# EAGLE design STC31 Breakout (EAGLE 9.6.2)
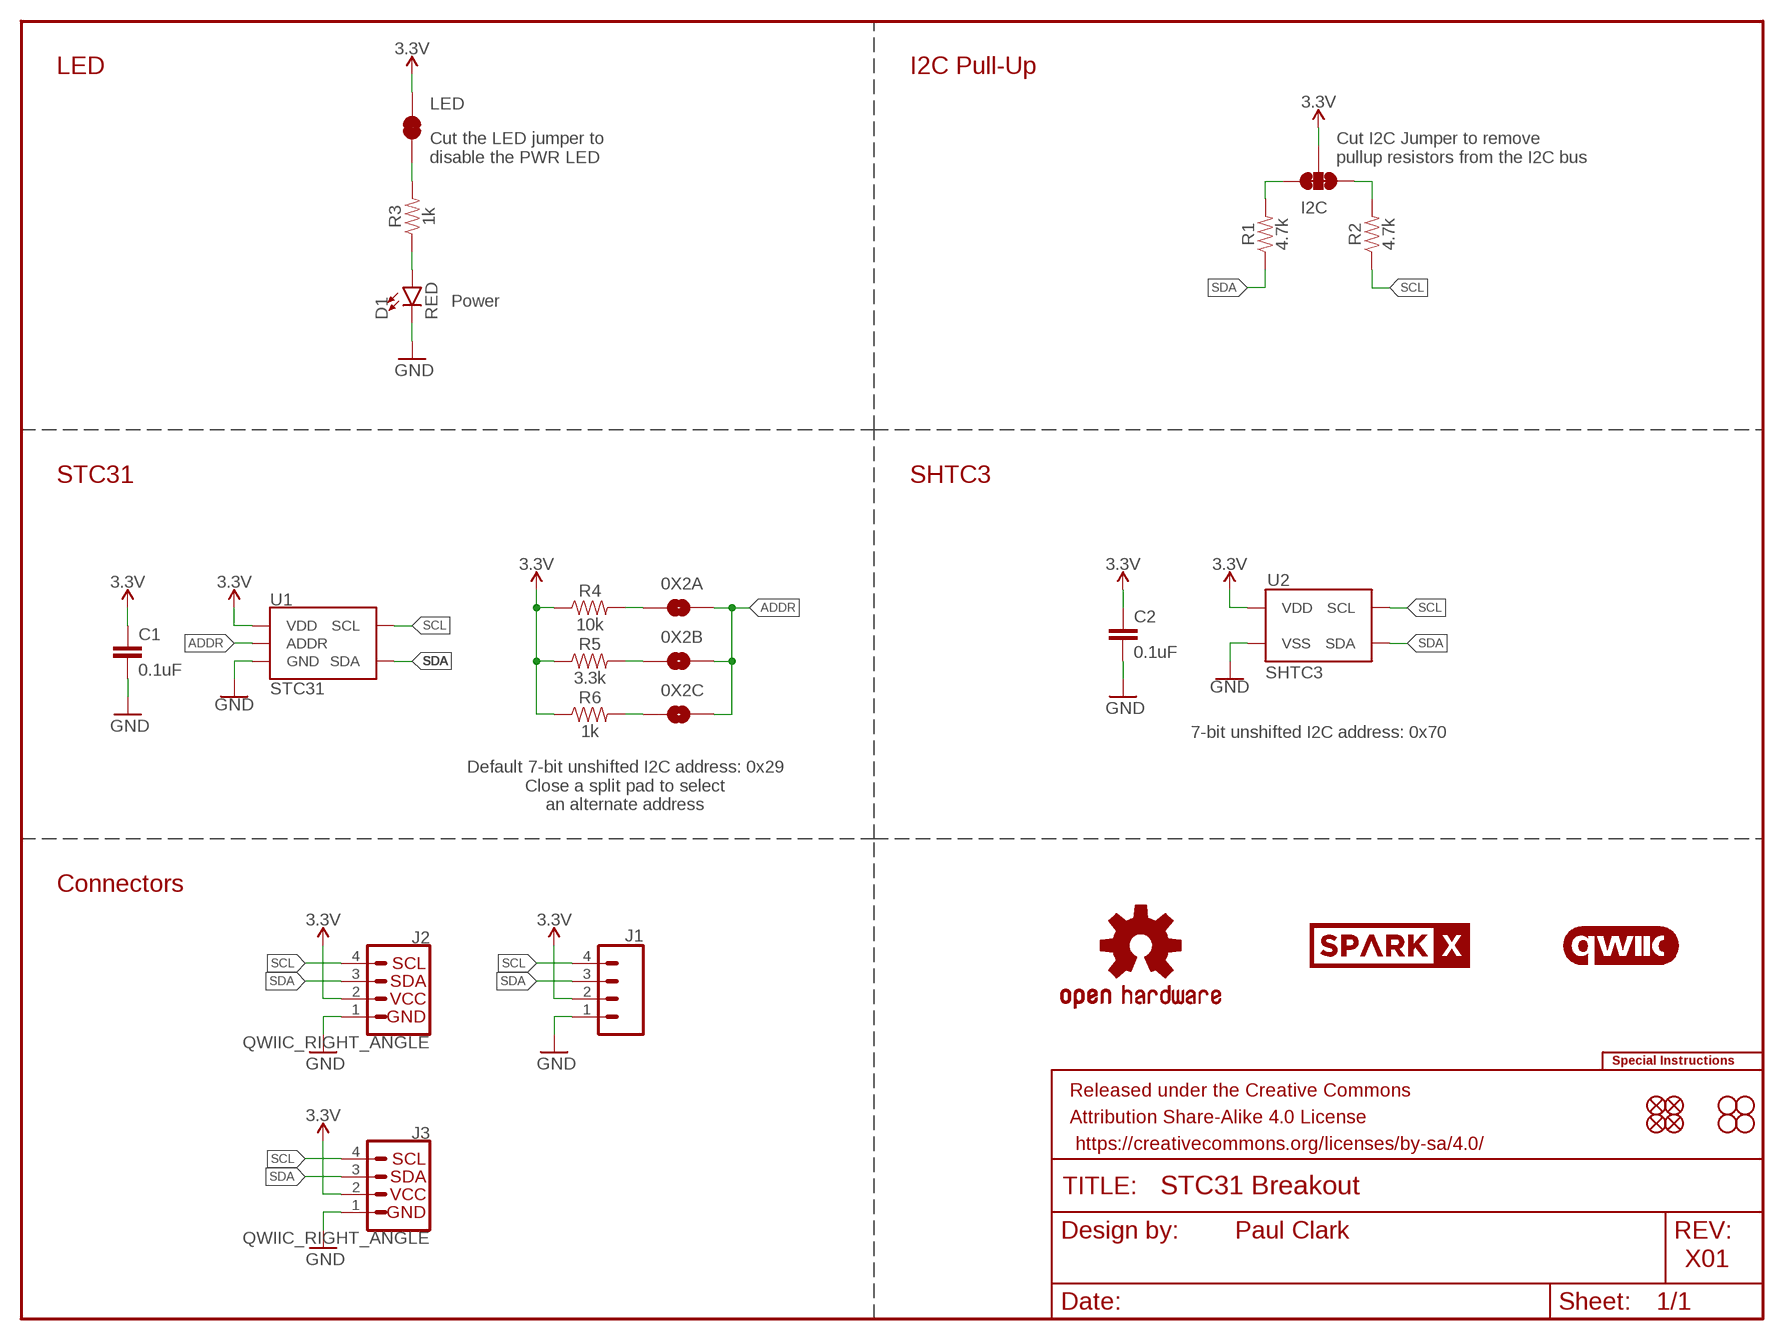
[diagram p0: schematic, sheet 1]

## Parts
0X2A  JUMPER-SMT_2_NO_SILK  [SMT-JUMPER_2_NO_SILK]
0X2B  JUMPER-SMT_2_NO_SILK  [SMT-JUMPER_2_NO_SILK]
0X2C  JUMPER-SMT_2_NO_SILK  [SMT-JUMPER_2_NO_SILK]
C1  0.1uF  0.1UF-0603-25V-5%  [0603]
C2  0.1uF  0.1UF-0603-25V-5%  [0603]
D1  RED  LED-RED0603  [LED-0603]
FRAME1  FRAME-LETTER  [CREATIVE_COMMONS]
I2C  JUMPER-SMT_3_2-NC_TRACE_SILK  [SMT-JUMPER_3_2-NC_TRACE_SILK]
J1  CONN_041X04_NO_SILK  [1X04_NO_SILK]
J2  QWIIC_RIGHT_ANGLE  QWIIC_CONNECTORJS-1MM  [JST04_1MM_RA]
J3  QWIIC_RIGHT_ANGLE  QWIIC_CONNECTORJS-1MM  [JST04_1MM_RA]
JP1  FIDUCIAL1X2  [FIDUCIAL-1X2]
JP2  FIDUCIAL1X2  [FIDUCIAL-1X2]
JP3  STAND-OFF  [STAND-OFF]
JP4  STAND-OFF  [STAND-OFF]
JP5  FIDUCIAL1X2  [FIDUCIAL-1X2]
JP6  FIDUCIAL1X2  [FIDUCIAL-1X2]
JP7  STAND-OFF  [STAND-OFF]
JP8  STAND-OFF  [STAND-OFF]
LED  JUMPER-SMT_2_NC_TRACE_SILK  [SMT-JUMPER_2_NC_TRACE_SILK]
LOGO1  SPECIAL_INSTRUCTIONS-ORDERING  [ORDERING_INSTRUCTIONS]
LOGO2  QWIIC_LOGO_5MM  [QWIIC_5MM]
LOGO5  OSHW-LOGOS  [OSHW-LOGO-S]
R1  4.7k  4.7KOHM-0603-1/10W-1%  [0603]
R2  4.7k  4.7KOHM-0603-1/10W-1%  [0603]
R3  1k  1KOHM-0603-1/10W-1%  [0603]
R4  10k  10KOHM-0603-1/10W-1%  [0603]
R5  3.3k  3.3KOHM-0603-1/10W-1%  [0603]
R6  1k  1KOHM-0603-1/10W-1%  [0603]
U1  STC31  [STC31]
U2  SHTC3  [SHTC3]
U$10  SPARKX-LOGO3  [SPARKX-SMALL]
U$18  SPARKX-LOGO3  [SPARKX-SMALL]

## Nets
3.3V: C1.1 C2.1 I2C.2 J1.2 J2.2 J3.2 LED.2 R4.1 R5.1 R6.1 U1.6(VDD) U2.1(VDD)
ADDR: 0X2A.2 0X2B.2 0X2C.2 U1.3(ADDR)
GND: C1.2 C2.2 D1.C J1.1 J2.1 J3.1 U1.1(GND) U1.5(GND) U1.9(GND) U1.11(GND) U1.DIEPAD(GND) U2.4(VSS) U2.5(VSS)
N$1: LED.1 R3.2
N$2: I2C.3 R1.2
N$3: D1.A R3.1
N$4: I2C.1 R2.2
N$5: 0X2A.1 R4.2
N$6: 0X2B.1 R5.2
N$7: 0X2C.1 R6.2
SCL: J1.4 J2.4 J3.4 R2.1 U1.4(SCL) U2.2(SCL)
SDA: J1.3 J2.3 J3.3 R1.1 U1.7(SDA) U2.3(SDA)

## Notes on the sheet
- LED | I2C Pull-Up
- Cut the LED jumper to
  disable the PWR LED
- Cut I2C Jumper to remove 
  pullup resistors from the I2C bus
- Power
- STC31 | SHTC3
- 7-bit unshifted I2C address: 0x70
- Default 7-bit unshifted I2C address: 0x29
  Close a split pad to select
  an alternate address
- Connectors
- Paul Clark
- X01

## Library data of the parts
0X2A 0X2B 0X2C = SparkFun-Jumpers:JUMPER-SMT_2_NO: Normally open jumper This jumper has two pads in close proximity to each other. Apply solder to close the connection. Round pads are easier to solder for beginners, but are a lot larger. SparkFun Product that uses the round pads: SparkFun EL Sequencer <https://www.sparkfun.com/products/12781>
C1 C2 = SparkFun-Capacitors:0.1UF: 0.1µF ceramic capacitors A capacitor is a passive two-terminal electrical component used to store electrical energy temporarily in an electric field.; PROD_ID: CAP-08604
D1 = SparkFun-LED:LED-RED: Red SMD LED Used in manufacturing of most products at SparkFun Packages: 0603 - SMD 0603 package [Product Link] <http://docs.avagotech.com/docs/AV02-0551EN> 0603 SMART - SMD 0603 SMART package ( more efficient and expensive)[Product Link] <http://www.osram-os.com/Graphics/XPic2/00077099_0.pdf> 1206 - SMD1206 package [Product Link] <https://www.sparkfun.com/datasheets/DevTools/LilyPad/Q150OVS4.pdff> SparkFun Products: Pro Mini 328 -5V <https://www.sparkfun.com/products/821> RedBoard <https://www.sparkfun.com/products/12757> IOIO-OTG <https://www.sparkfun.com/products/13613>; PROD_ID: DIO-00819
FRAME1 = SparkFun-Aesthetics:FRAME-LETTER: Schematic Frame - Letter Standard 8.5x11 US Letter frame
I2C = SparkFun-Jumpers:JUMPER-SMT_3_2-NC_TRACE: Normally closed trace jumper (2 of 2 connections) This jumper has a trace between all three pads so they are normally closed (NC). Use a razor knife to open the connection(s). For best results follow the IPC guidelines for cutting traces: Cutout at least 0.063 mm (0.005 in). Remove all loose material to clean up the cut area. Seal the cut with an approved epoxy. Reapply solder to reclose the connection(s).
J1 = SparkFun-Connectors:CONN_04: Multi connection point. Often used as Generic Header-pin footprint for 0.1 inch spaced/style header connections On any of the 0.1 inch spaced packages, you can populate with these: Break Away Headers - Straight <https://www.sparkfun.com/products/116> (PRT-00116) Break Away Male Headers - Right Angle <https://www.sparkfun.com/products/553> (PRT-00553) Female Headers <https://www.sparkfun.com/products/115> (PRT-00115) Break Away Headers - Machine Pin <https://www.sparkfun.com/products/117> (PRT-00117) Break Away Female Headers - Swiss Machine Pin <https://www.sparkfun.com/products/743> (PRT-00743) For SCREWTERMINALS and SPRING TERMINALS visit here: Screw Terimnals on SparkFun.com <https://www.sparkfun.com/search/results?term=Screw+Terminals> (5mm/3.5mm/2.54mm spacing) This device is also useful as a general connection point to wire up your design to another part of your project. Our various solder wires solder well into these plated through hole pads. Hook-Up Wire - Assortment (Stranded, 22 AWG) <https://www.sparkfun.com/products/11375> (PRT-11375) Hook-Up Wire - Assortment (Solid Core, 22 AWG) <https://www.sparkfun.com/products/11367> (PRT-11367) View the entire wire category on our website here <https://www.sparkfun.com/categories/141> Special notes: Molex polarized connector foot print use with SKU : PRT-08231 with associated crimp pins and housings. 1MM SMD Version SKU: PRT-10208; PROD_ID: CONN-09696
J2 J3 = SparkFun-Connectors:QWIIC_CONNECTOR: SparkFun I2C Standard Qwiic Connector An SMD 1mm pitch JST connector makes it easy and quick (get it? Qwiic?) to connect I2C devices to each other. The Qwiic system <http://www.sparkfun.com/qwiic> enables fast and solderless connection between popular platforms and various sensors and actuators. We carry 200mm <https://www.sparkfun.com/products/14204>, 100mm <https://www.sparkfun.com/products/14205>, 50mm <https://www.sparkfun.com/products/14206>, and breadboard friendly <https://www.sparkfun.com/products/14207> Qwiic cables. We also offer 10 pcs strips <https://www.sparkfun.com/products/14323> the SMD connectors.; PROD_ID: CONN-13694
JP1 JP2 JP5 JP6 = SparkFun-Aesthetics:FIDUCIAL: Fiducial Alignment Points Point-of-reference for pick-and-place machines and other optical instruments.
JP3 JP4 JP7 JP8 = SparkFun-Hardware:STAND-OFF: Stand Off Drill holes for mechanically mounting via screws, standoffs, etc. Note: Use the keepout ring to avoid running the screw head into surrounding components. Variant Overviews STAND-OFF - Mechanical footprint for a #4 phillips button head screw. STAND-OFF-TIGHT - Mechanical footprint for a #4 phillips button head screw, Example SparkFun Products Screw - Phillips Head (1/4", 4-40, 10 pack) <https://www.sparkfun.com/products/10453> (PRT-10453) Screw - Phillips Head (1/2", 4-40, 10 pack) <https://www.sparkfun.com/products/10452> (PRT-10452) Screw - Phillips Head (3/4", 4-40, 10 pack) <https://www.sparkfun.com/products/10451> (PRT-10451) Screw - Phillips Head (1", 4-40, 10 pack) <https://www.sparkfun.com/products/10450> (PRT-10450)
LED = SparkFun-Jumpers:JUMPER-SMT_2_NC_TRACE: Normally closed trace jumper This jumper has a trace between two pads so it's normally closed (NC). Use a razor knife to open the connection. For best results follow the IPC guidelines for cutting traces: Cutout at least 0.063 mm (0.005 in). Remove all loose material to clean up the cut area. Seal the cut with an approved epoxy. Reapply solder to reclose the connection.
LOGO1 = SparkFun-Aesthetics:SPECIAL_INSTRUCTIONS: Special Ordering/Production Instructions Alert Symbol for special PCB ordering instructions or unique production process warnings. Ordering Instructions Production Instructions Types of information that should be added to box: Copper weight Soldermask color Silk color PCB thickness Number of layers PCB Standard: 1.6mm FR4 1 oz copper immersion silver plating red soldermask white silkscreen Types of information that should be added to box: Special wash requirements Depaneling instructions Humidification Glue curing Default text settings: 0.07 inch 9% ratio 50% line distance
LOGO2 = SparkFun-Aesthetics:QWIIC_LOGO: Qwiic Logos for placement on schematic and PCB. The 5.5mm silk logo is best for placing next to Qwiic connector.
LOGO5 = SparkFun-Aesthetics:OSHW-LOGO: Open-Source Hardware (OSHW) Logo This logo indicates the piece of hardware it is found on incorporates a OSHW license and/or adheres to the definition of open source hardware found here: http://freedomdefined.org/OSHW
R1 R2 = SparkFun-Resistors:4.7KOHM: 4.7kΩ resistor A resistor is a passive two-terminal electrical component that implements electrical resistance as a circuit element. Resistors act to reduce current flow, and, at the same time, act to lower voltage levels within circuits. - Wikipedia; PROD_ID: RES-07857
R3 R6 = SparkFun-Resistors:1KOHM: 1kΩ resistor A resistor is a passive two-terminal electrical component that implements electrical resistance as a circuit element. Resistors act to reduce current flow, and, at the same time, act to lower voltage levels within circuits. - Wikipedia; PROD_ID: RES-07856
R4 = SparkFun-Resistors:10KOHM: 10kΩ resistor A resistor is a passive two-terminal electrical component that implements electrical resistance as a circuit element. Resistors act to reduce current flow, and, at the same time, act to lower voltage levels within circuits. - Wikipedia; PROD_ID: RES-00824
R5 = SparkFun-Resistors:3.3KOHM: 3.3kΩ resistor A resistor is a passive two-terminal electrical component that implements electrical resistance as a circuit element. Resistors act to reduce current flow, and, at the same time, act to lower voltage levels within circuits. - Wikipedia; PROD_ID: RES-07851
U1 = SparkFun-Sensors:STC31: STC31 CO2 Sensor Based on Thermal Conductivity; MANU_PART: STC31-R3; PROD_ID: IC-16076
U2 = SparkFun-Sensors:SHTC3: Sensirion SHTC3 Humidity Sensor The SHTC3 is a digital humidity and temperature sensor designed especially for battery-driven high-volume consumer electronics applications.; PROD_ID: IC-14840
U$10 U$18 = SparkX:SPARKX-LOGO

## Net classes
1 power: width 0.203 mm

## Board
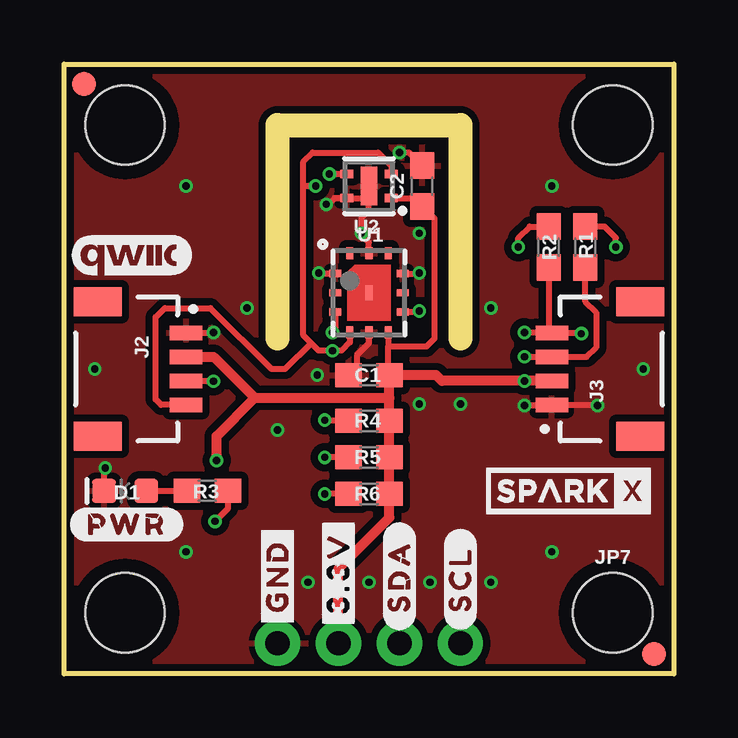
[diagram p1: board, top side]
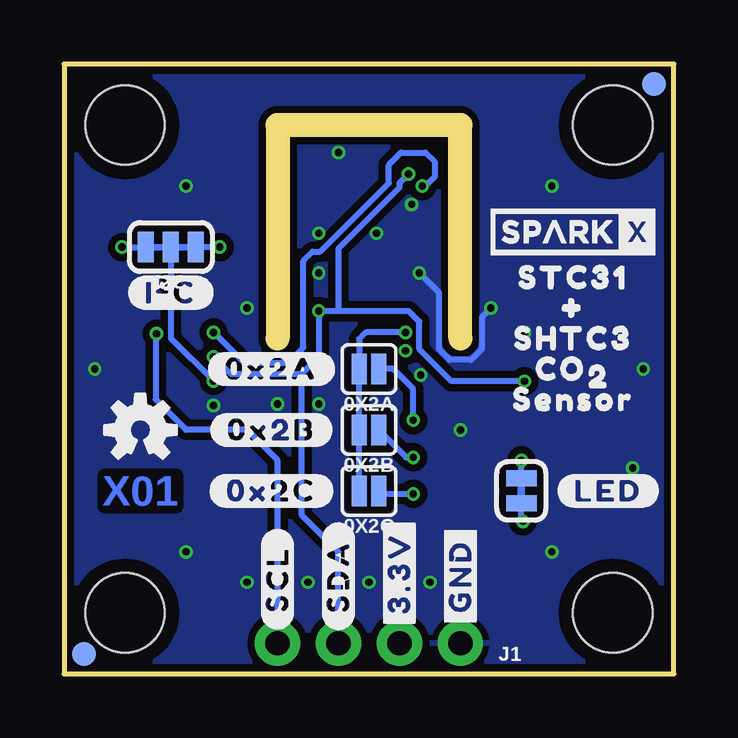
[diagram p2: board, bottom side, seen from below]

Size 25.4 x 25.4 mm. Coordinates in mm from the lower left corner, seen from the top.
Outline: 0,0 0,25.4 25.4,25.4 25.4,0 0,0
Copper layers (1*16): Top 0.035mm / dielectric 1.5mm / Bottom 0.035mm
Design rules "SparkFun-2-Layer-Minimum-JLCPCB": minimum track width 5mil, minimum drill 0.3mm, track to track 5mil, track to pad 5mil, pad to pad 5mil, via to via 5mil, smd to smd 5mil, copper to edge 7mil, drill to drill 7mil, minimum pad ring 5mil, minimum via ring 5mil, stop-mask expansion 2.5mil, vias tented up to drill 25mil, thermal gap 10mil
tRestrict: 3 lines
bRestrict: 3 lines
Milling: 3 lines

### Footprints (pad centres in the part's own frame; a part is rotated, then mirrored left to right if it is on the bottom)
SMT-JUMPER_2_NO_SILK = smd 0.635 x 1.27: 1 -0.406,0; 2 0.406,0
0603 = smd 1.1 x 1: 1 -0.85,0; 2 0.85,0
LED-0603 = smd 1 x 1: A -0.877,0; C 0.877,0
SMT-JUMPER_3_2-NC_TRACE_SILK = smd 0.66 x 1.27: 1 -1.041,0; 2 0,0; 3 1.041,0
1X04_NO_SILK = drill 1.016 pad 1.88: 1 0,0; 2 2.54,0; 3 5.08,0; 4 7.62,0
JST04_1MM_RA = smd 0.6 x 1.35: 1 -1.5,0; 2 -0.5,0; 3 0.5,0; 4 1.5,0 | smd 1.2 x 2: NC1 2.8,-3.675; NC2 -2.8,-3.675
FIDUCIAL-1X2 = smd 1 x 1: 1 0,0
STAND-OFF = hole 3.302: 0,0
SMT-JUMPER_2_NC_TRACE_SILK = smd 0.66 x 1.27: 1 -0.521,0; 2 0.521,0
STC31 = smd 0.5 x 0.3: 1 -1.4,0.8; 2 -1.4,0; 3 -1.4,-0.8; 7 1.4,-0.8; 8 1.4,0; 9 1.4,0.8 | smd 0.3 x 0.5: 4 -0.8,-1.65; 5 0,-1.65; 6 0.8,-1.65; 10 0.8,1.65; 11 0,1.65; 12 -0.8,1.65 | smd 0.305 x 0.61: DIEPAD 0,0
SHTC3 = smd 0.55 x 0.35: 1 -0.925,0.5; 2 -0.925,-0.5; 3 0.925,-0.5; 4 0.925,0.5 | smd 0.7 x 1.6: 5 0,0

### Placement (x,y rotation side)
0X2A  12.7,12.7 180 bottom
0X2B  12.7,10.16 180 bottom
0X2C  12.7,7.62 180 bottom
C1  12.7,12.45 180 top
C2  14.92,20.32 90 top
D1  2.54,7.62 180 top
FRAME1  45.72,-10.16 0 top  (outside the outline)
I2C  20.95,17.78 180 bottom
J1  8.89,1.27 180 bottom
J2  5.08,12.7 270 top
J3  20.32,12.7 90 top
JP1  0.83,24.57 0 bottom
JP2  24.57,0.83 0 top
JP3  2.54,22.86 0 top
JP4  22.86,22.86 0 top
JP5  24.57,0.83 0 bottom
JP6  0.83,24.57 0 top
JP7  22.86,2.54 0 top
JP8  2.54,2.54 0 top
LED  6.35,7.62 90 bottom
LOGO1  30.48,50.8 0 top  (outside the outline)
LOGO2  2.79,17.46 0 top
LOGO5  22.23,10.16 0 bottom
R1  21.72,17.78 90 top
R2  20.19,17.78 90 top
R3  5.97,7.62 0 top
R4  12.7,10.54 180 top
R5  12.7,9.02 180 top
R6  12.7,7.49 180 top
U1  12.7,15.88 0 top
U2  12.7,20.32 180 top
U$1  [#GND#0]  8.89,4.06 90 bottom
U$2  [#3#3V#0]  11.43,4.19 90 bottom
U$3  [#SDA#0]  13.97,4.06 90 bottom
U$4  [#SCL#0]  16.51,3.94 90 bottom
U$5  [#LED#0]  2.73,7.62 0 bottom
U$6  [#0X2A#0]  16.76,12.7 0 bottom
U$7  [#0X2B#0]  16.76,10.16 0 bottom
U$8  [#0X2C#0]  16.76,7.62 0 bottom
U$9  [#I�C#0]  20.95,15.88 0 bottom
U$10  21.02,7.62 0 top
U$11  [STC310]  4.19,16.51 0 bottom
U$12  [#0]  4.19,15.24 0 bottom
U$13  [SHTC30]  4.19,13.97 0 bottom
U$14  [CO0]  4.7,12.7 0 bottom
U$15  [20]  3.11,12.38 0 bottom
U$16  [SENSOR0]  4.19,11.43 0 bottom
U$18  4.19,18.41 0 bottom
U$32  [#PWR#0]  2.6,6.22 0 top
U$33  [#GND#0]  8.89,4.06 90 top
U$34  [#3#3V#0]  11.43,4.19 90 top
U$35  [#SDA#0]  13.97,4.06 90 top
U$36  [#SCL#0]  16.51,3.94 90 top

### Tracks (layer width: path | path; a pad name or v marks a point on that pad's centre or on a via)
3.3V  (via drill 0.3)
  Top 0.254: U1.6 13.5,13.63 | 13.5,13.63 15.09,13.63 15.43,13.97 15.43,18.96 C2.1 14.57,19.82 U2.1 | C1.1 13.5,12.5 13.5,13.63
  Top 0.406: J1.2 11.43,4.38 13.55,6.5 R6.1 R5.1 R4.1 13.55,11.49 | J3.2 v19.18,12.2 15.74,12.2 15.49,12.45 C1.1 13.55,11.49 | v6.35,8.89 6.35,9.91 7.94,11.49 | J2.2 6.23,13.2 7.94,11.49 | 7.94,11.49 13.55,11.49
  Bottom 0.254: I2C.2 20.95,13.98 v19.18,12.2 | LED.2 v6.35,8.89
ADDR  (via drill 0.3)
  Top 0.254: U1.3 11.3,14.38 11.18,14.25 v11.18,14.22
  Bottom 0.254: 0X2C.2 0X2B.2 0X2A.2 13.11,13.95 12.83,14.22 v11.18,14.22
GND  (via drill 0.3)
  Top 0.254: U1.1 10.63,16.68 v10.6,16.7 | U1.9 14.77,16.68 v14.8,16.7 | C2.2 14.38,21.72 v13.97,21.72 | v10.92,19.56 11.01,19.56 11.27,19.82 U2.4 12.63,19.82 12.7,19.75 U2.5 12.7,19.3 12.38,18.99 v12.38,18.35 12.38,18.29 12.7,17.97 U1.11 | J2.1 6.2,14.2 v6.22,14.22 | v19.18,11.18 20.3,11.18 J3.1 22.2,11.2 v22.23,11.18 | D1.C 1.66,8.52 v1.71,8.57 | U1.5 12.7,13.78 12.19,13.27 12.19,12.79 C1.2
  Bottom 0.254: v7.62,15.24 8,14.86 8,13.53 8.45,13.08 9.34,13.08 9.78,13.53 9.78,15.88 v10.6,16.7
  other vias: 14.8,18.35 5.08,20.32 20.32,20.32 17.78,15.24 1.27,12.7 24.13,12.7 5.08,5.08 20.32,5.08 8.89,10.16 16.51,11.24 14.8,11.24 12.7,3.81 15.24,3.81 17.78,3.81 10.16,3.81 10.54,12.45
  pour Bottom (isolate 0.305): 0,0 0,25.4 25.4,25.4 25.4,0
  pour Top (isolate 0.305): 0,0 0,25.4 25.4,25.4 25.4,0
N$1  (via drill 0.3)
  Top 0.254: R3.2 6.82,6.88 v6.29,6.35
  Bottom 0.254: v6.29,6.35 6.35,6.41 LED.1
N$2  (via drill 0.3)
  Top 0.254: R1.2 22.52,18.63 22.99,18.16 v22.99,17.78
  Bottom 0.254: v22.99,17.78 I2C.3
N$3
  Top 0.254: D1.A R3.1
N$4  (via drill 0.3)
  Top 0.254: R2.2 19.39,18.63 18.92,18.16 v18.92,17.78
  Bottom 0.254: v18.92,17.78 I2C.1
N$5  (via drill 0.3)
  Top 0.254: R4.2 10.89,10.54 v10.86,10.57
  Bottom 0.254: v10.86,10.57 10.86,11.87 11.68,12.7 0X2A.1
N$6  (via drill 0.3)
  Top 0.254: R5.2 v10.86,9.02
  Bottom 0.254: 0X2B.1 11.15,9.02 v10.86,9.02
N$7  (via drill 0.3)
  Top 0.254: R6.2 v10.86,7.49
  Bottom 0.254: 0X2C.1 12.17,7.49 v10.86,7.49
SCL  (via drill 0.3)
  Top 0.254: U1.4 11.9,13.8 11.56,13.46 v11.18,13.46 10.6,13.46 10.29,13.78 | J3.4 20.19,14.33 R2.1 | J2.4 4.04,11.2 3.81,11.43 3.81,14.86 4.19,15.24 6.1,15.24 8.64,12.7 9.21,12.7 10.29,13.78 | 10.29,13.78 9.97,14.1 9.97,20.32 | U2.2 13.62,21.17 13.08,21.72 10.35,21.72 9.97,21.34 9.97,20.32 | J3.4 19.2,14.2 v19.18,14.22 | v10.48,20.32 9.97,20.32 | J3.4 21.52,14.2 v21.55,14.17
  Bottom 0.254: v19.18,14.22 17.91,12.95 16.07,12.95 15.43,13.59 15.43,17.21 15.05,17.59 14.73,17.59 11.87,20.45 11.87,21.21 11.37,21.72 10.35,21.72 9.97,21.34 9.97,20.7 10.35,20.32 v10.48,20.32 | J1.4 16.51,8.89 17.78,10.16 20.32,10.16 21.59,11.43 21.59,14.13 v21.55,14.17
SDA  (via drill 0.3)
  Top 0.254: U1.7 14.76,15.07 v14.8,15.11 | U2.3 v11.06,20.82 v11.05,20.83 | v19.18,13.21 J3.3 21.77,13.2 22.16,13.59 22.16,15.06 21.72,15.5 R1.1 | J2.3 v6.21,12.2 v6.22,12.19
  Bottom 0.254: v11.05,20.83 11.43,20.45 11.43,20.26 13.97,17.72 13.97,15.11 | 15.49,12.51 18.48,12.51 v19.18,13.21 | v6.22,12.19 9.27,12.19 10.6,13.53 10.6,14.67 11.05,15.11 13.97,15.11 | 13.97,15.11 v14.8,15.11 14.8,13.21 15.49,12.51 | J1.3 13.97,5.08 15.49,6.6 15.49,12.51

### Text on the board
Bottom: X01
Measures: Dimensions in inches
tDocu: 2 Layers / 1.6mm Thickness / HASL Finish | Paul Clark